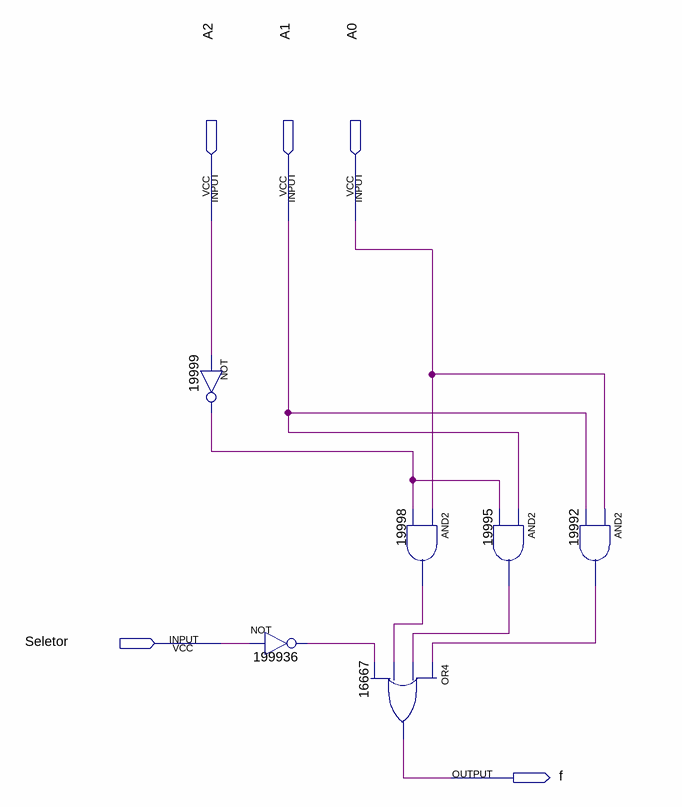
[diagram p0: schematic sheet]
// Quartus schematic segmeto_f.bdf as structural Verilog: 6 symbols, 5 pins
module segmeto_f (
  input  A2,
  input  A1,
  input  A0,
  input  Seletor,
  output f
);

  wire n19992_out, n19995_out, n19998_out, n19999_out, n199936_out;

  not u_19999 (n19999_out, A2);
  not u_199936 (n199936_out, Seletor);
  or u_16667 (f, n19992_out, n19995_out, n19998_out, n199936_out);
  and u_19998 (n19998_out, A0, n19999_out);
  and u_19995 (n19995_out, A1, n19999_out);
  and u_19992 (n19992_out, A0, A1);
endmodule
